# Altium project MdBBCar_MotorSensor.PrjPcb
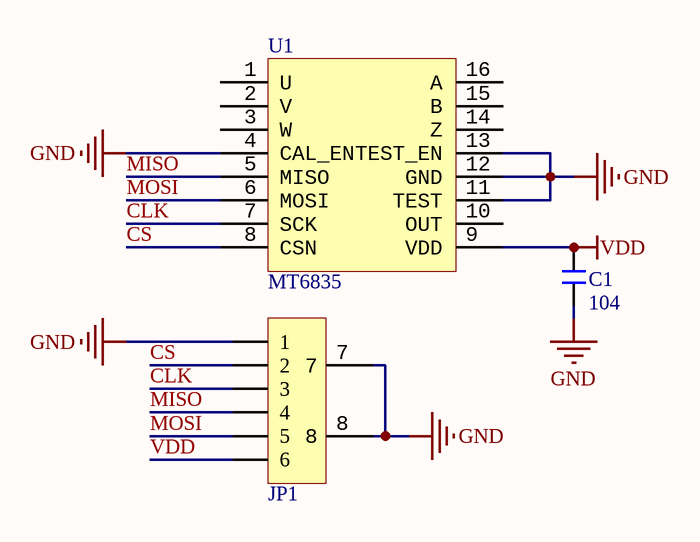
[diagram p0: Sheet1.SchDoc]
1 sheet, 3 parts. Net scope: global (net labels, ports and power ports of the same name join across sheets).
Board file: MdBBCar_MotorSensor.PcbDoc

## Sheet Sheet1.SchDoc
size A4; SheetNumber: 1; SheetTotal: 1

### Parts
C1  104  [C 0402_L]
JP1  HDR-1X6  [GH1.25-WS-6P]  (value not drawn)
U1  MT6835  [TSSOP16_L]

### Nets
GND: C1.1 JP1.1 JP1.7 JP1.8 U1.4(CAL_EN) U1.11(TEST) U1.12(GND) U1.13(TEST_EN)
VDD: C1.2 JP1.6 U1.9(VDD)
CLK: JP1.3 U1.7(SCK)
CS: JP1.2 U1.8(CSN)
MISO: JP1.4 U1.5(MISO)
MOSI: JP1.5 U1.6(MOSI)

Not connected (* = marked no-connect by the designer): U1 1(U) 2(V) 3(W) 10(OUT) 14(Z) 15(B) 16(A)

### Library data of the parts
C1 = C: 无极性贴片电容; 版权归属: 源创客; BOM名称: 无极性贴片电容; 学习资源: www.ooocke.com
JP1 = Header 6: 6P接插件; 版权归属: 源创客; BOM名称: 6P接插件; 学习资源: www.ooocke.com
U1 = MT6835: 21bit磁编码芯片